# EAGLE design motor_controlboard (EAGLE 8.0.1)
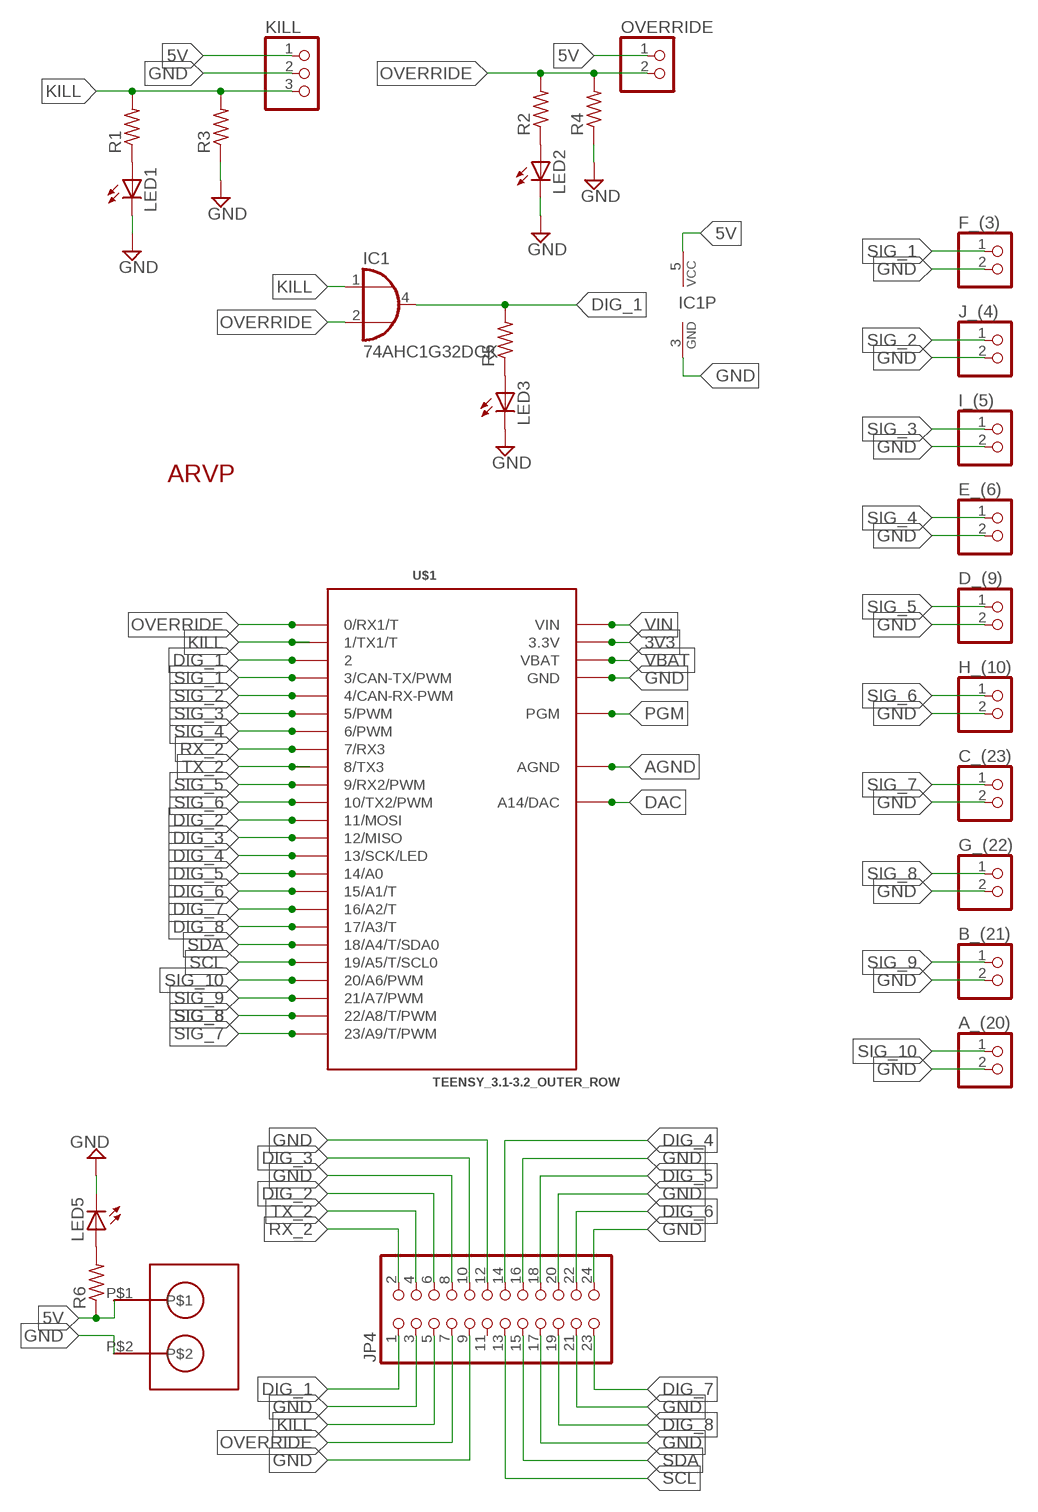
[diagram p0: schematic, sheet 1]

## Parts
A_(20)  PINHD-1X2  [1X02]
B_(21)  PINHD-1X2  [1X02]
C_(23)  PINHD-1X2  [1X02]
D_(9)  PINHD-1X2  [1X02]
E_(6)  PINHD-1X2  [1X02]
F_(3)  PINHD-1X2  [1X02]
G_(22)  PINHD-1X2  [1X02]
H_(10)  PINHD-1X2  [1X02]
I_(5)  PINHD-1X2  [1X02]
IC1  74AHC1G32DCK  [SC70-5]
J_(4)  PINHD-1X2  [1X02]
JP4  PINHD-2X12  [2X12]
KILL  PINHD-1X3  [1X03]
LED1  LEDCHIP-LED0805  [CHIP-LED0805]
LED2  LEDCHIP-LED0805  [CHIP-LED0805]
LED3  LEDCHIP-LED0805  [CHIP-LED0805]
LED5  LEDCHIP-LED0805  [CHIP-LED0805]
OVERRIDE  PINHD-1X2  [1X02]
R1  R-US_R0805  [R0805]
R2  R-US_R0805  [R0805]
R3  R-US_R0805  [R0805]
R4  R-US_R0805  [R0805]
R5  R-US_R0805  [R0805]
R6  R-US_R0805  [R0805]
U$1  TEENSY_3.1-3.2_OUTER_ROW  [TEENSY_3.0-3.2&LC_OUTER_ROW]
U$2  ARVP_LOGO  [ARVP]
U$3  ARVP_MOLEX_FEMALE  [ARVP_MOLEX_FEMALE]

## Nets
3V3: U$1.3.3V U$1.3.3V1(3.3V)
5V: IC1.5(VCC) KILL.1 OVERRIDE.1 R6.1 U$3.P$1
AGND: U$1.AGND
DAC: U$1.RESET/DAC(A14/DAC)
DIG_1: IC1.4(O) JP4.1 R5.2 U$1.2
DIG_2: JP4.6 U$1.11(11/MOSI)
DIG_3: JP4.10 U$1.12(12/MISO)
DIG_4: JP4.14 U$1.13(13/SCK/LED)
DIG_5: JP4.18 U$1.14/A0
DIG_6: JP4.22 U$1.15/A1(15/A1/T)
DIG_7: JP4.23 U$1.16/A2(16/A2/T)
DIG_8: JP4.19 U$1.17/A3(17/A3/T)
GND: A_(20).2 B_(21).2 C_(23).2 D_(9).2 E_(6).2 F_(3).2 G_(22).2 H_(10).2 I_(5).2 IC1.3(GND) J_(4).2 JP4.3 JP4.8 JP4.9 JP4.12 JP4.16 JP4.17 JP4.20 JP4.21 JP4.24 KILL.2 LED1.C LED2.C LED3.C LED5.C R3.1 R4.1 U$1.GND U$1.GND1(GND) U$3.P$2
KILL: IC1.1(I0) JP4.5 KILL.3 R1.2 R3.2 U$1.1(1/TX1/T)
N$1: LED1.A R1.1
N$2: LED2.A R2.1
N$3: LED3.A R5.1
N$4: LED5.A R6.2
OVERRIDE: IC1.2(I1) JP4.7 OVERRIDE.2 R2.2 R4.2 U$1.0(0/RX1/T)
PGM: U$1.PGM
RX_2: JP4.2 U$1.7(7/RX3)
SCL: JP4.13 U$1.19/A5(19/A5/T/SCL0)
SDA: JP4.15 U$1.18/A4(18/A4/T/SDA0)
SIG_1: F_(3).1 U$1.3(3/CAN-TX/PWM)
SIG_2: J_(4).1 U$1.4(4/CAN-RX-PWM)
SIG_3: I_(5).1 U$1.5(5/PWM)
SIG_4: E_(6).1 U$1.6(6/PWM)
SIG_5: D_(9).1 U$1.9(9/RX2/PWM)
SIG_6: H_(10).1 U$1.10(10/TX2/PWM)
SIG_7: C_(23).1 U$1.23/A9(23/A9/T/PWM)
SIG_8: G_(22).1 U$1.22/A8(22/A8/T/PWM)
SIG_9: B_(21).1 U$1.21/A7(21/A7/PWM)
SIG_10: A_(20).1 U$1.20/A6(20/A6/PWM)
TX_2: JP4.4 U$1.8(8/TX3)
VBAT: U$1.VBAT
VIN: U$1.VIN
Unconnected: JP4.11

## Library data of the parts
A_(20) B_(21) C_(23) D_(9) E_(6) F_(3) G_(22) H_(10) I_(5) J_(4) OVERRIDE = pinhead:PINHD-1X2: PIN HEADER
IC1 = 74xx-little-de:74*1G32: 2-input OR gate
JP4 = pinhead:PINHD-2X12: PIN HEADER
KILL = pinhead:PINHD-1X3: PIN HEADER
LED1-LED3 LED5 = led:LED: LED OSRAM: - CHIPLED LG R971, LG N971, LY N971, LG Q971, LY Q971, LO R971, LY R971 LH N974, LH R974 LS Q976, LO Q976, LY Q976 LO Q996 - Hyper CHIPLED LW Q18S LB Q993, LB Q99A, LB R99A - SideLED LS A670, LO A670, LY A670, LG A670, LP A670 LB A673, LV A673, LT A673, LW A673 LH A674 LY A675 LS A676, LA A676, LO A676, LY A676, LW A676 LS A679, LY A679, LG A679 - Hyper Micro SIDELED® LS Y876, LA Y876, LO Y876, LY Y876 LT Y87S - SmartLED LW L88C, LW L88S LB L89C, LB L89S, LG L890 LS L89K, LO L89K, LY L89K LS L896, LA L896, LO L896, LY L896 - TOPLED LS T670, LO T670, LY T670, LG T670, LP T670 LSG T670, LSP T670, LSY T670, LOP T670, LYG T670 LG T671, LOG T671, LSG T671 LB T673, LV T673, LT T673, LW T673 LH T674 LS T676, LA T676, LO T676, LY T676, LB T676, LH T676, LSB T676, LW T676 LB T67C, LV T67C, LT T67C, LS T67K, LO T67K, LY T67K, LW E67C LS E67B, LA E67B, LO E67B, LY E67B, LB E67C, LV E67C, LT E67C LW T67C LS T679, LY T679, LG T679 LS T770, LO T770, LY T770, LG T770, LP T770 LB T773, LV T773, LT T773, LW T773 LH T774 LS E675, LA E675, LY E675, LS T675 LS T776, LA T776, LO T776, LY T776, LB T776 LHGB T686 LT T68C, LB T68C - Hyper Mini TOPLED® LB M676 - Mini TOPLED Santana® LG M470 LS M47K, LO M47K, LY M47K Source: http://www.osram.convergy.de LUXEON: - LUMILED® LXK2-PW12-R00, LXK2-PW12-S00, LXK2-PW14-U00, LXK2-PW14-V00 LXK2-PM12-R00, LXK2-PM12-S00, LXK2-PM14-U00 LXK2-PE12-Q00, LXK2-PE12-R00, LXK2-PE12-S00, LXK2-PE14-T00, LXK2-PE14-U00 LXK2-PB12-K00, LXK2-PB12-L00, LXK2-PB12-M00, LXK2-PB14-N00, LXK2-PB14-P00, LXK2-PB14-Q00 LXK2-PR12-L00, LXK2-PR12-M00, LXK2-PR14-Q00, LXK2-PR14-R00 LXK2-PD12-Q00, LXK2-PD12-R00, LXK2-PD12-S00 LXK2-PH12-R00, LXK2-PH12-S00 LXK2-PL12-P00, LXK2-PL12-Q00, LXK2-PL12-R00 Source: www.luxeon.com KINGBRIGHT: KA-3528ASYC Source: www.kingbright.com
R1-R6 = rcl:R-US_: RESISTOR, American symbol
U$1 = Teensy_3_and_LC_Series_Boards_v1.4:TEENSY_3.1-3.2_OUTER_ROW: Footprint for Teensy 3.1 or 3.2 board using all pin connections on the outer perimeter
U$2 = ARVP:ARVP_LOGO
U$3 = ARVP_MOLEX_FEMALE:ARVP_MOLEX_FEMALE

## Net classes
0 default: width 0.457 mm, drill 0.762 mm, clearance 0.356 mm

## Board
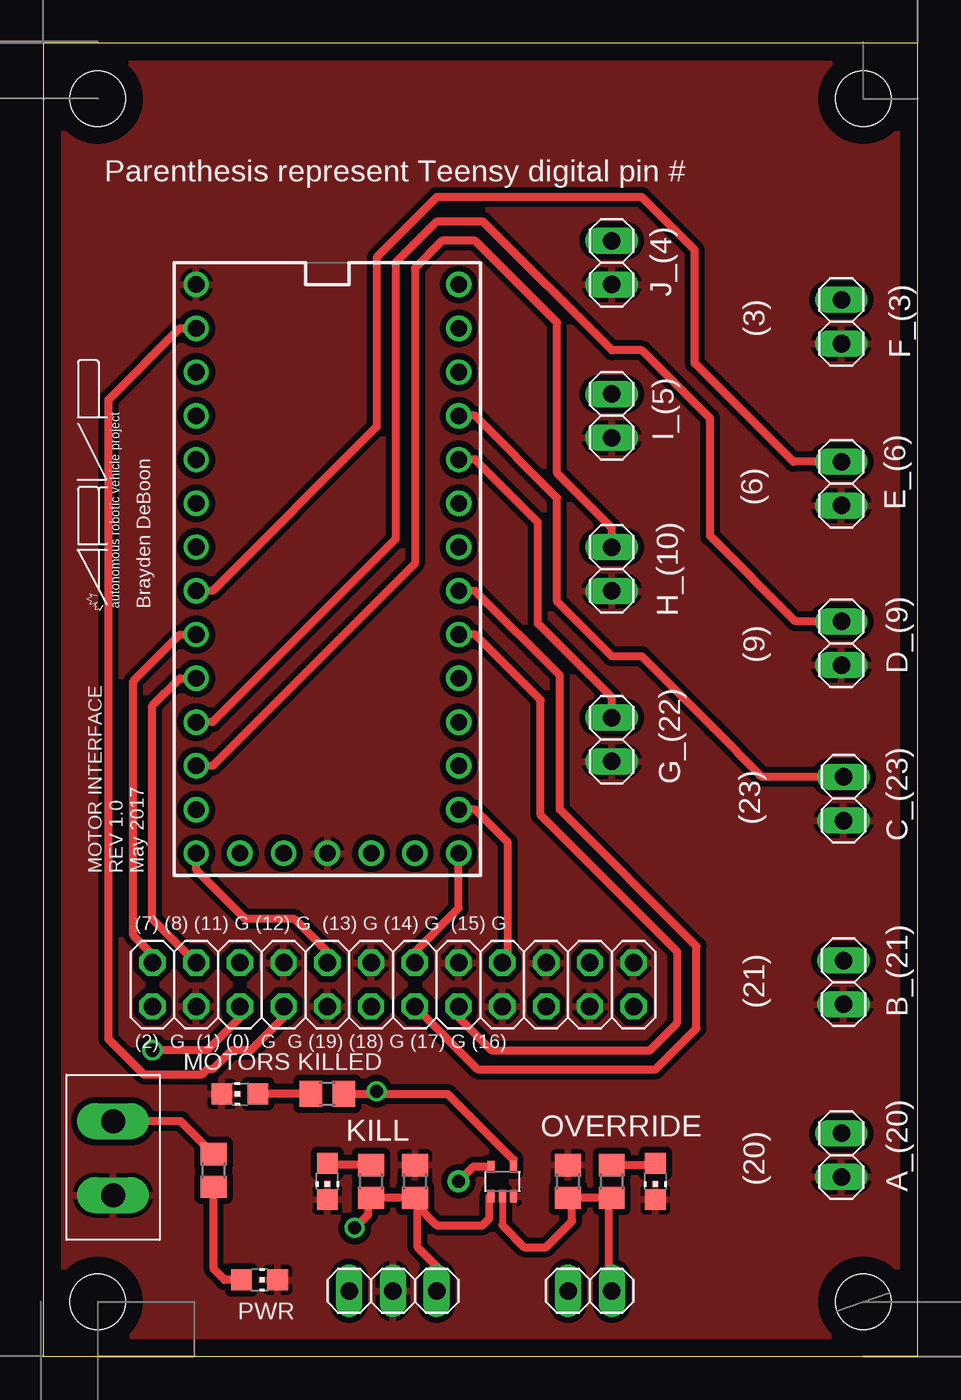
[diagram p1: board, top side]
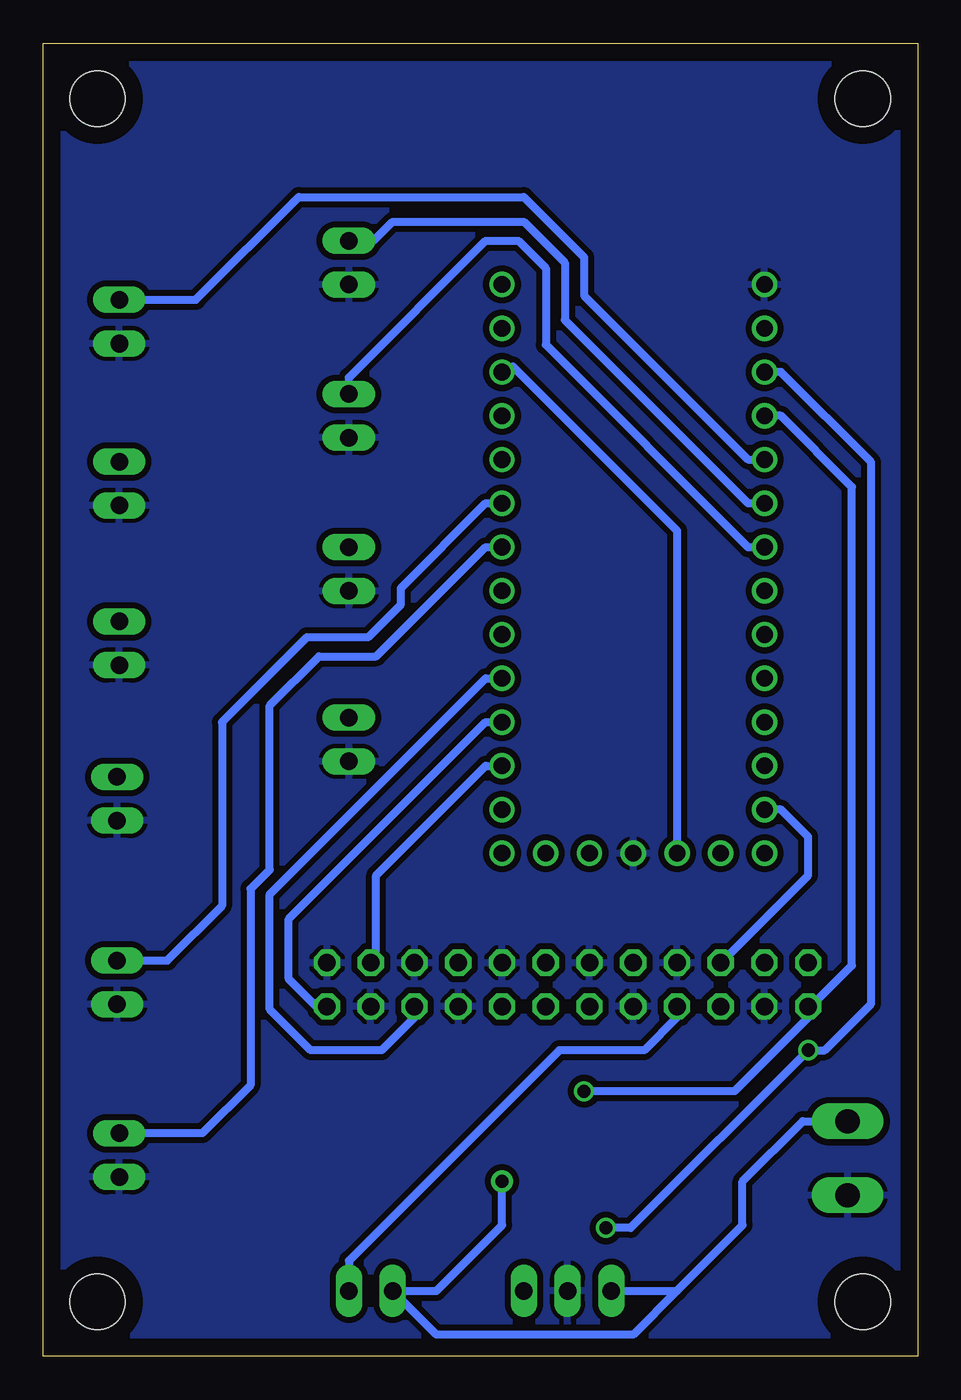
[diagram p2: board, bottom side, seen from below]

Size 50.78 x 76.25 mm. Coordinates in mm from the lower left corner, seen from the top.
Outline: 0,0 50.78,0 50.78,76.25 0,76.25 0,0
Copper layers (1*16): Top 0.035mm / dielectric 1.5mm / Bottom 0.035mm
Design rules "default": minimum track width 10mil, minimum drill 24mil, track to track 8mil, track to pad 8mil, pad to pad 8mil, via to via 8mil, smd to smd 8mil, copper to edge 40mil, drill to drill 8mil, minimum pad ring 10mil, minimum via ring 8mil, stop-mask expansion 4mil, vias tented up to drill 0mil, thermal gap 10mil
Holes 3.2 mm at 3.17,73.03 47.62,73.03 47.62,3.17 3.17,3.17

### Footprints (pad centres in the part's own frame; a part is rotated, then mirrored left to right if it is on the bottom)
1X02 = drill 1.016 long: 1 -1.27,0; 2 1.27,0
SC70-5 = smd 0.4 x 0.7: 1 -0.65,-0.85; 2 0,-0.85; 3 0.65,-0.85; 4 0.65,0.85; 5 -0.65,0.85
2X12 = drill 1.016 octagon: 1 -13.97,-1.27; 2 -13.97,1.27; 3 -11.43,-1.27; 4 -11.43,1.27; 5 -8.89,-1.27; 6 -8.89,1.27; 7 -6.35,-1.27; 8 -6.35,1.27; 9 -3.81,-1.27; 10 -3.81,1.27; 11 -1.27,-1.27; 12 -1.27,1.27; 13 1.27,-1.27; 14 1.27,1.27; 15 3.81,-1.27; 16 3.81,1.27; 17 6.35,-1.27; 18 6.35,1.27; 19 8.89,-1.27; 20 8.89,1.27; 21 11.43,-1.27; 22 11.43,1.27; 23 13.97,-1.27; 24 13.97,1.27
1X03 = drill 1.016 long: 1 -2.54,0; 2 0,0; 3 2.54,0
CHIP-LED0805 = smd 1.2 x 1.2: A 0,-1.05; C 0,1.05
R0805 = smd 1.3 x 1.5: 1 -0.95,0; 2 0.95,0
TEENSY_3.0-3.2&LC_OUTER_ROW = drill 0.965: 0 -7.62,13.97; 1 -7.62,11.43; 2 -7.62,8.89; 3 -7.62,6.35; 3.3V 7.62,11.43; 3.3V1 -2.54,-16.51; 4 -7.62,3.81; 5 -7.62,1.27; 6 -7.62,-1.27; 7 -7.62,-3.81; 8 -7.62,-6.35; 9 -7.62,-8.89; 10 -7.62,-11.43; 11 -7.62,-13.97; 12 -7.62,-16.51; 13 7.62,-16.51; 14/A0 7.62,-13.97; 15/A1 7.62,-11.43; 16/A2 7.62,-8.89; 17/A3 7.62,-6.35; 18/A4 7.62,-3.81; 19/A5 7.62,-1.27; 20/A6 7.62,1.27; 21/A7 7.62,3.81; 22/A8 7.62,6.35; 23/A9 7.62,8.89; AGND 7.62,13.97; GND -7.62,16.51; GND1 0,-16.51; PGM 2.54,-16.51; RESET/DAC 5.08,-16.51; VBAT -5.08,-16.51; VIN 7.62,16.51
ARVP_MOLEX_FEMALE = drill 1.4 long: P$1 -2.1,0; P$2 2.2,0

### Placement (x,y rotation side)
A_(20)  46.35,11.68 270 top
B_(21)  46.48,21.72 270 top
C_(23)  46.48,32.38 270 top
D_(9)  46.35,41.4 270 top
E_(6)  46.35,50.67 270 top
F_(3)  46.35,60.07 270 top
G_(22)  33.02,35.81 270 top
H_(10)  33.02,45.72 270 top
I_(5)  33.02,54.61 270 top
IC1  26.67,10.16 0 top
J_(4)  33.02,63.5 270 top
JP4  20.32,21.59 0 top
KILL  20.32,3.81 0 top
LED1  16.51,10.16 180 top
LED2  35.56,10.16 180 top
LED3  11.43,15.24 90 top
LED5  12.57,4.45 270 top
OVERRIDE  31.75,3.81 0 top
R1  19.05,10.16 270 top
R2  33.02,10.16 270 top
R3  21.59,10.16 270 top
R4  30.48,10.16 270 top
R5  16.51,15.24 0 top
R6  9.91,10.79 270 top
U$1  16.51,45.72 0 top
U$2  4.45,43.43 90 top
U$3  4.06,11.56 270 top

### Tracks (layer width: path | path; a pad name or v marks a point on that pad's centre or on a via)
3V3
  Bottom 0.457: U$1.3.3V1 13.97,47.94 23.5,57.47 23.81,57.47 U$1.3.3V
5V  (via drill 0.76 pad 1.27)
  Top 0.457: IC1.5 24.98,11.01 v24.13,10.16 | R6.1 7.99,13.66 U$3.P$1
  Bottom 0.457: KILL.1 13.97,3.81 | 13.97,3.81 10.16,7.62 10.16,10.16 6.66,13.66 U$3.P$1 | 13.97,3.81 16.51,1.27 27.94,1.27 OVERRIDE.1 27.94,3.81 24.13,7.62 v24.13,10.16
DIG_1  (via drill 0.76)
  Top 0.406: IC1.4 27.32,11.41
  Top 0.457: R5.2 19.37,15.24 | 19.37,15.24 23.5,15.24 26.99,11.75 27.32,11.41 | v19.37,15.4 19.37,15.24
  Bottom 0.457: U$1.2 7.94,54.61 3.81,50.48 3.81,22.7 6.19,20.32 JP4.1 6.35,19.68 10.64,15.4 v19.37,15.4
DIG_2
  Bottom 0.457: U$1.11 7.94,31.75 6.35,30.16 6.35,27.94 JP4.6
DIG_3
  Top 0.457: U$1.12 8.89,28.26 11.75,25.4 14.61,25.4 16.51,23.5 JP4.10
DIG_4
  Top 0.457: U$1.13 24.13,26.04 21.59,23.5 JP4.14
DIG_5
  Top 0.457: U$1.14/A0 25.08,31.75 26.99,29.84 26.99,23.18 JP4.18
DIG_6
  Bottom 0.457: U$1.15/A1 25.08,34.29 31.43,27.94 31.43,23.18 JP4.22
DIG_7
  Bottom 0.457: U$1.16/A2 25.08,36.83 36.51,25.4 36.51,21.91 34.92,20.32 JP4.23
DIG_8
  Bottom 0.457: U$1.17/A3 25.08,39.37 37.62,26.83 37.62,20.16 35.24,17.78 31.11,17.78 29.21,19.68 JP4.19
GND
  pour Bottom: -0.13,79.25 0,0 54.1,-0.13 53.98,79.12
  pour Top: -0.13,77.47 0,0 53.21,-0.51 52.32,77.47
KILL  (via drill 0.76)
  Top 0.457: R3.2 R1.2 18.89,9.05 18.89,8.26 v18.1,7.46 | KILL.3 22.86,5.24 21.75,6.35 21.75,9.05 R3.2 | v6.35,17.78 9.53,17.78 11.43,19.68 JP4.5 | R3.2 21.59,8.89 22.86,7.62 25.53,7.62 25.91,8 25.91,9.27 25.95,9.31 IC1.1
  Bottom 0.457: U$1.1 7.94,57.15 2.7,51.91 2.7,20.48 5.4,17.78 v6.35,17.78 16.67,7.46 v18.1,7.46
N$1
  Top 0.457: LED1.A 16.51,11.11 R1.1
N$2
  Top 0.457: LED2.A 35.56,11.11 R2.1
N$3
  Top 0.457: R5.1 LED3.A
N$4
  Top 0.457: LED5.A 10.54,4.45 9.91,5.08 R6.2
OVERRIDE
  Top 0.406: IC1.2 26.67,7.62
  Top 0.457: OVERRIDE.2 32.86,3.97 32.86,9.05 R2.2 R4.2 30.72,8.97 30.72,7.86 29.21,6.35 27.94,6.35 26.67,7.62 | U$1.0 7.94,59.69 3.81,55.56 3.81,18.41 5.87,16.35 9.21,16.35 9.53,16.67 9.84,16.67 10.95,17.78 12.06,17.78 13.97,19.68 JP4.7
  Bottom 0.457: OVERRIDE.2 33.02,5.56 20.8,17.78 15.88,17.78 13.97,19.68 JP4.7
RX_2
  Top 0.457: U$1.7 7.94,41.91 5.24,39.21 5.24,24.45 6.35,23.34 JP4.2
SCL
  Top 0.457: U$1.19/A5 25.08,44.45 30,39.53 30,31.75 37.94,23.81 37.94,19.05 35.56,16.67 25.24,16.67 JP4.13
SDA
  Top 0.457: U$1.18/A4 25.08,41.91 28.89,38.1 28.89,31.43 36.83,23.5 36.83,19.37 35.24,17.78 26.04,17.78 24.13,19.68 JP4.15
SIG_1
  Bottom 0.457: U$1.3 9.84,52.07 19.37,61.59 19.37,63.82 22.86,67.31 35.94,67.31 41.91,61.34 F_(3).1
SIG_2
  Bottom 0.457: U$1.4 9.84,49.53 20.48,60.17 20.48,63.5 22.86,65.88 30.48,65.88 31.59,64.77 J_(4).1
SIG_3
  Bottom 0.457: U$1.5 9.84,46.99 21.59,58.74 21.59,63.18 23.18,64.77 25.08,64.77 33.02,56.83 I_(5).1
SIG_4
  Top 0.457: U$1.6 9.84,44.45 19.37,53.98 19.37,63.82 22.86,67.31 34.77,67.31 37.85,64.23 37.85,57.66 43.56,51.94 E_(6).1
SIG_5
  Top 0.457: U$1.9 9.84,36.83 20.48,47.47 20.48,63.5 22.86,65.88 25.56,65.88 33.02,58.42 34.77,58.42 38.73,54.45 38.73,47.62 43.69,42.67 D_(9).1
SIG_6
  Top 0.457: U$1.10 9.84,34.29 21.59,46.04 21.59,63.18 23.18,64.77 25.08,64.77 29.84,60.01 29.84,51.28 33.02,48.1 H_(10).1
SIG_7
  Top 0.457: U$1.23/A9 25.08,54.61 29.84,49.85 29.84,43.81 33.02,40.64 34.77,40.64 38.89,36.51 | 38.89,36.51 38.92,36.51 | C_(23).1 41.75,33.66 38.89,36.51
SIG_8
  Top 0.457: U$1.22/A8 25.08,52.07 28.73,48.42 28.73,42.55 33.02,38.26 G_(22).1
SIG_9
  Bottom 0.457: U$1.21/A7 25.08,49.53 30,44.61 30,43.66 31.91,41.75 35.47,41.75 40.39,36.83 40.39,26.16 43.56,22.99 B_(21).1
SIG_10
  Bottom 0.457: U$1.20/A6 25.08,46.99 31.43,40.64 34.77,40.64 37.62,37.78 37.62,28.26 38.73,27.15 38.73,15.75 41.53,12.95 A_(20).1
TX_2
  Top 0.457: U$1.8 7.94,39.37 6.35,37.78 6.35,25.4 JP4.4

### Text on the board
tPlace: Parenthesis represent Teensy digital pin # | (3) | (6) | Brayden DeBoon | (9) | (23) | MOTOR INTERFACE / REV 1.0 / May 2017 | (7) (8) (11) G (12) G (13) G (14) G (15) G | (21) | (2) G (1) (0) G G (19) (18) G (17) G (16) | MOTORS KILLED | (20) | PWR
tDocu: ALL MOUNTING HOLES ARE 1/8" IN DIAMETER. / THESE MOUNTING HOLES ARE 1/8" AWAY FROM THE EDGES W/ RESPECT TO X AND Y